# Altium schematic sheet LPDDR4.SchDoc
size A3; SheetNumber: 3; SheetTotal: 20
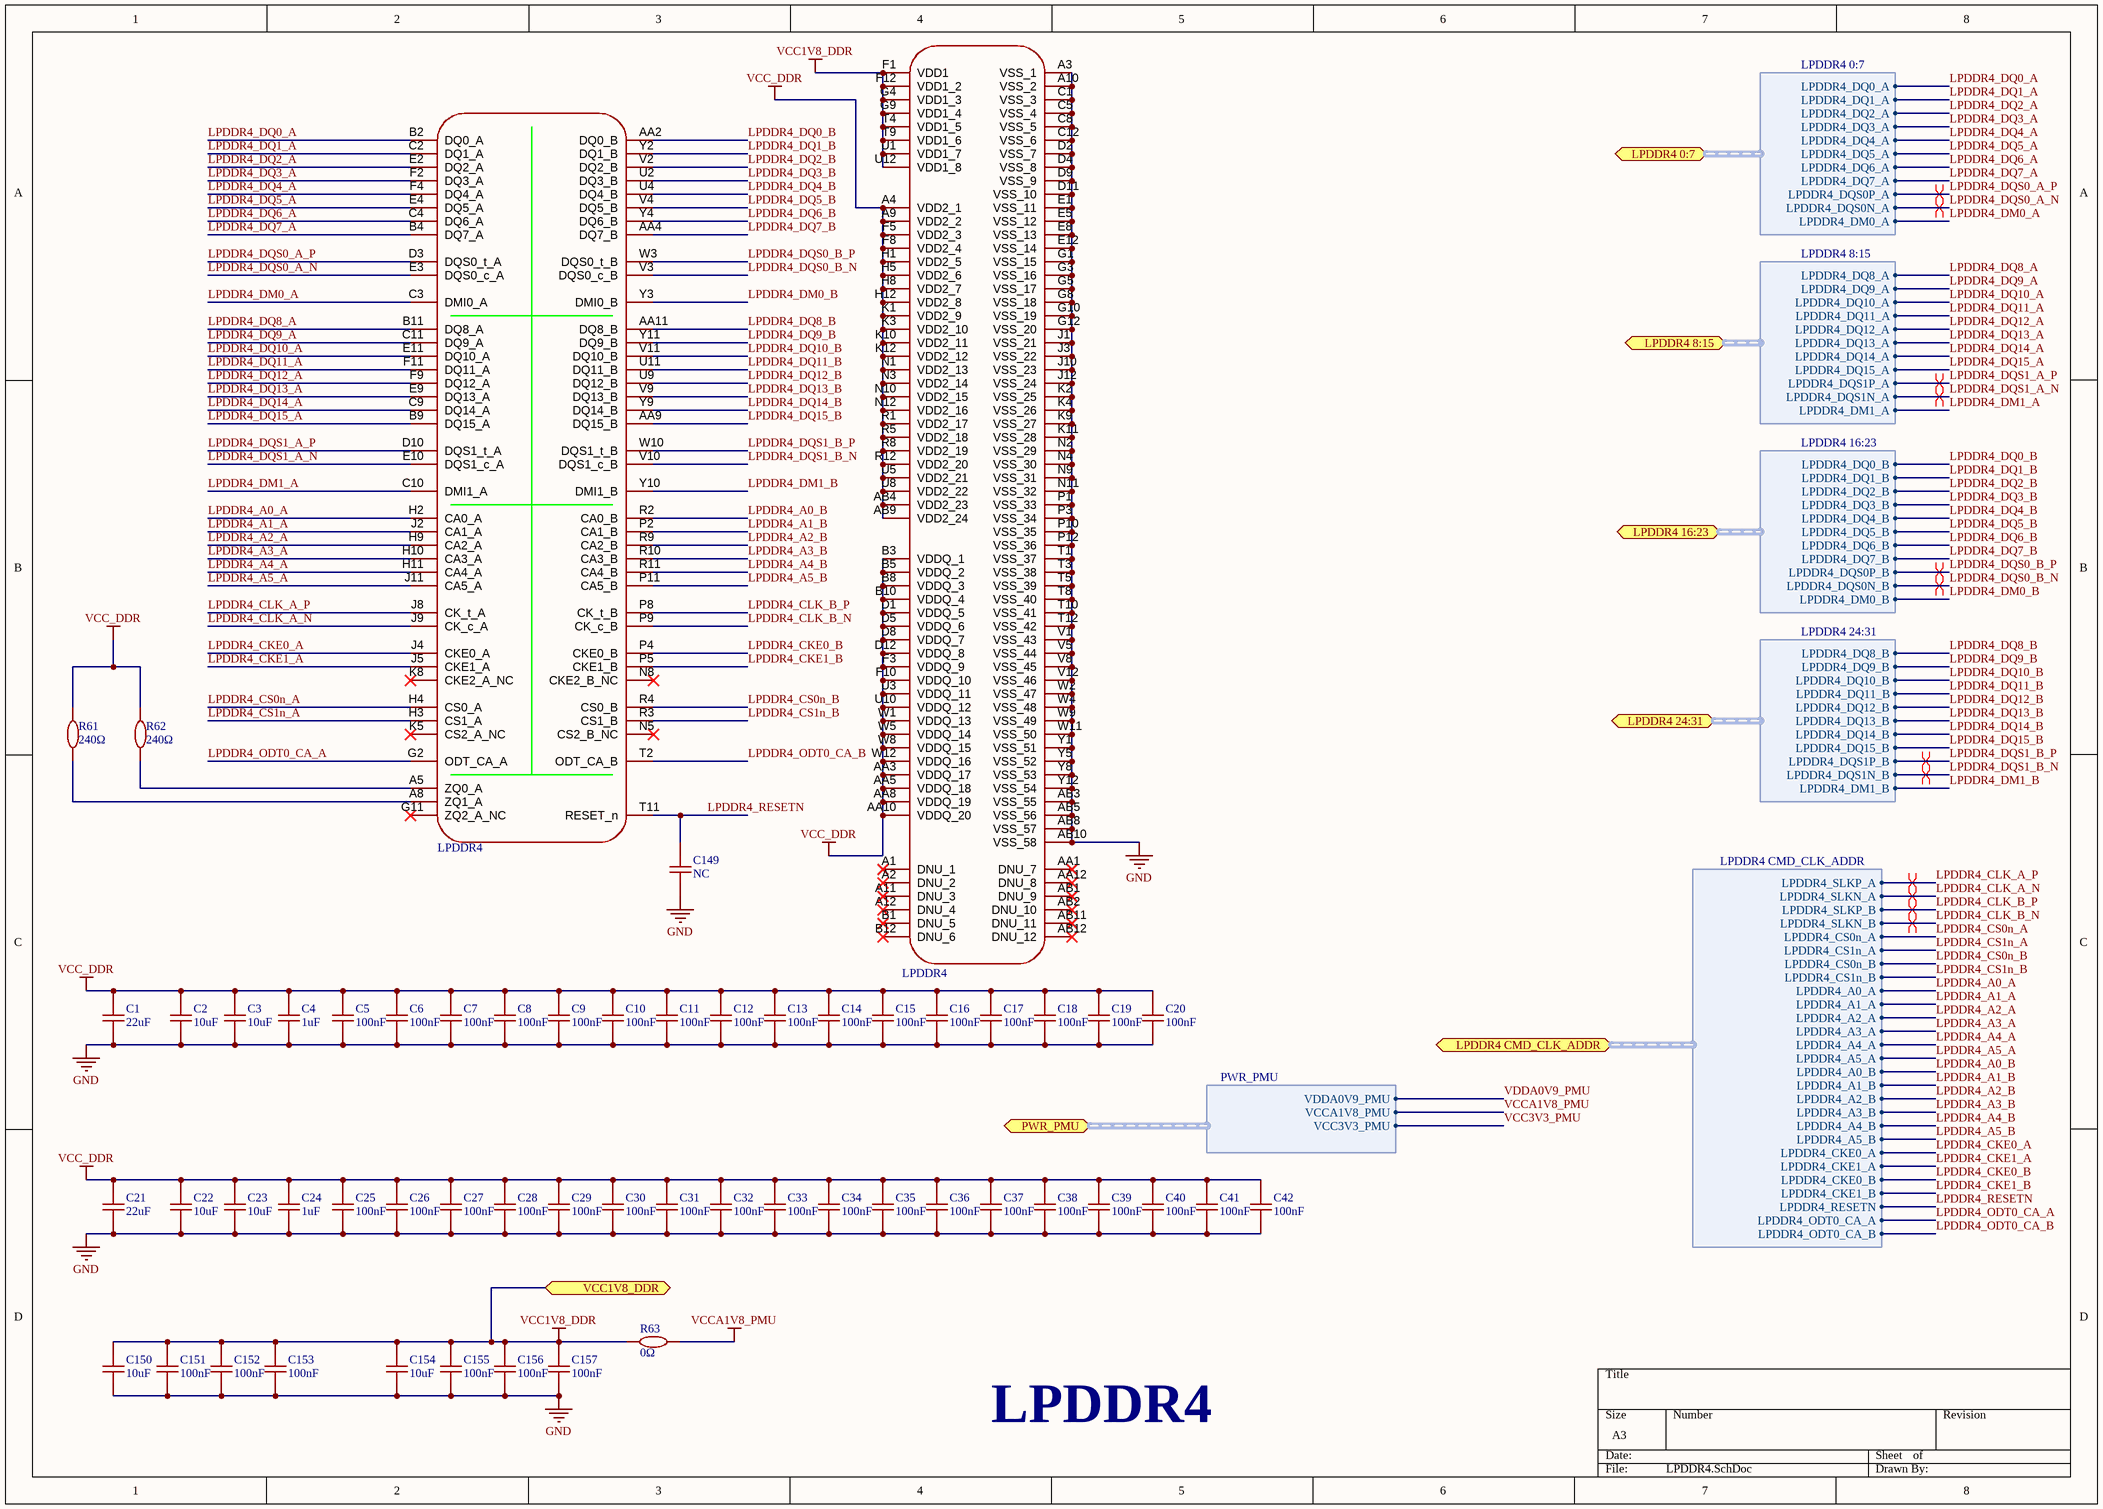
[diagram p0: LPDDR4.SchDoc]

## Parts
C1  22uF  [C0603]
C2  10uF  [C0603]
C3  10uF  [C0603]
C4  1uF  [C0402]
C5  100nF  [C0402]
C6  100nF  [C0402]
C7  100nF  [C0402]
C8  100nF  [C0402]
C9  100nF  [C0402]
C10  100nF  [C0402]
C11  100nF  [C0402]
C12  100nF  [C0402]
C13  100nF  [C0402]
C14  100nF  [C0402]
C15  100nF  [C0402]
C16  100nF  [C0402]
C17  100nF  [C0402]
C18  100nF  [C0402]
C19  100nF  [C0402]
C20  100nF  [C0402]
C21  22uF  [C0603]
C22  10uF  [C0603]
C23  10uF  [C0603]
C24  1uF  [C0402]
C25  100nF  [C0402]
C26  100nF  [C0402]
C27  100nF  [C0402]
C28  100nF  [C0402]
C29  100nF  [C0402]
C30  100nF  [C0402]
C31  100nF  [C0402]
C32  100nF  [C0402]
C33  100nF  [C0402]
C34  100nF  [C0402]
C35  100nF  [C0402]
C36  100nF  [C0402]
C37  100nF  [C0402]
C38  100nF  [C0402]
C39  100nF  [C0402]
C40  100nF  [C0402]
C41  100nF  [C0402]
C42  100nF  [C0402]
C149  NC  [C0402]
C150  10uF  [C0603]
C151  100nF  [C0402]
C152  100nF  [C0402]
C153  100nF  [C0402]
C154  10uF  [C0603]
C155  100nF  [C0402]
C156  100nF  [C0402]
C157  100nF  [C0402]
R61  240Ω  [R0402]
R62  240Ω  [R0402]
R63  0Ω  [R0402]
U1  LPDDR4  [FBGA-200_L15.0-W10.0-BL_H9HCNNNBKUMLXR]  (parts A,B of 2)

## Ports
LPDDR4 0:7 (bidir, harness LPDDR4 0:7, see Overview[6B], RK3566[2A], RK3566_DDR_PHY[3@]), LPDDR4 8:15 (bidir, harness LPDDR4 8:15, see Overview[6B], RK3566[2A], RK3566_DDR_PHY[3@]), LPDDR4 16:23 (bidir, harness LPDDR4 16:23, see Overview[6B], RK3566[2A], RK3566_DDR_PHY[3A]), LPDDR4 24:31 (bidir, harness LPDDR4 24:31, see Overview[6B], RK3566[2A], RK3566_DDR_PHY[3B]), LPDDR4 CMD_CLK_ADDR (bidir, harness LPDDR4 CMD_CLK_ADDR, see Overview[6B], RK3566[2A], RK3566_DDR_PHY[3C]), PWR_PMU (bidir, harness PWR_PMU, see Overview[7B], POWER[2D], POWER_PMIC[4D], RK3566[3C], RK3566_OSC_PLL_PMUO1_2[1A]), VCC1V8_DDR (bidir)

## Harnesses
LPDDR4 0:7: LPDDR4_DQ0_A, LPDDR4_DQ1_A, LPDDR4_DQ2_A, LPDDR4_DQ3_A, LPDDR4_DQ4_A, LPDDR4_DQ5_A, LPDDR4_DQ6_A, LPDDR4_DQ7_A, LPDDR4_DQS0P_A, LPDDR4_DQS0N_A, LPDDR4_DM0_A
LPDDR4 8:15: LPDDR4_DQ8_A, LPDDR4_DQ9_A, LPDDR4_DQ10_A, LPDDR4_DQ11_A, LPDDR4_DQ12_A, LPDDR4_DQ13_A, LPDDR4_DQ14_A, LPDDR4_DQ15_A, LPDDR4_DQS1P_A, LPDDR4_DQS1N_A, LPDDR4_DM1_A
LPDDR4 16:23: LPDDR4_DQ0_B, LPDDR4_DQ1_B, LPDDR4_DQ2_B, LPDDR4_DQ3_B, LPDDR4_DQ4_B, LPDDR4_DQ5_B, LPDDR4_DQ6_B, LPDDR4_DQ7_B, LPDDR4_DQS0P_B, LPDDR4_DQS0N_B, LPDDR4_DM0_B
LPDDR4 24:31: LPDDR4_DQ8_B, LPDDR4_DQ9_B, LPDDR4_DQ10_B, LPDDR4_DQ11_B, LPDDR4_DQ12_B, LPDDR4_DQ13_B, LPDDR4_DQ14_B, LPDDR4_DQ15_B, LPDDR4_DQS1P_B, LPDDR4_DQS1N_B, LPDDR4_DM1_B
LPDDR4 CMD_CLK_ADDR: LPDDR4_SLKP_A, LPDDR4_SLKN_A, LPDDR4_SLKP_B, LPDDR4_SLKN_B, LPDDR4_CS0n_A, LPDDR4_CS1n_A, LPDDR4_CS0n_B, LPDDR4_CS1n_B, LPDDR4_A0_A, LPDDR4_A1_A, LPDDR4_A2_A, LPDDR4_A3_A, LPDDR4_A4_A, LPDDR4_A5_A, LPDDR4_A0_B, LPDDR4_A1_B, LPDDR4_A2_B, LPDDR4_A3_B, LPDDR4_A4_B, LPDDR4_A5_B, LPDDR4_CKE0_A, LPDDR4_CKE1_A, LPDDR4_CKE0_B, LPDDR4_CKE1_B, LPDDR4_RESETN, LPDDR4_ODT0_CA_A, LPDDR4_ODT0_CA_B
PWR_PMU: VCCA1V8_PMU, VDDA0V9_PMU, VCC3V3_PMU

## Nets
GND: C1.1 C2.1 C3.1 C4.1 C5.1 C6.1 C7.1 C8.1 C9.1 C10.1 C11.1 C12.1 C13.1 C14.1 C15.1 C16.1 C17.1 C18.1 C19.1 C20.1 C21.1 C22.1 C23.1 C24.1 C25.1 C26.1 C27.1 C28.1 C29.1 C30.1 C31.1 C32.1 C33.1 C34.1 C35.1 C36.1 C37.1 C38.1 C39.1 C40.1 C41.1 C42.1 C149.1 C150.1 C151.1 C152.1 C153.1 C154.1 C155.1 C156.1 C157.1 U1.A3(VSS_1) U1.A10(VSS_2) U1.AB3(VSS_55) U1.AB5(VSS_56) U1.AB8(VSS_57) U1.AB10(VSS_58) U1.C1(VSS_3) U1.C5(VSS_4) U1.C8(VSS_5) U1.C12(VSS_6) U1.D2(VSS_7) U1.D4(VSS_8) U1.D9(VSS_9) U1.D11(VSS_10) U1.E1(VSS_11) U1.E5(VSS_12) U1.E8(VSS_13) U1.E12(VSS_14) U1.G1(VSS_15) U1.G3(VSS_16) U1.G5(VSS_17) U1.G8(VSS_18) U1.G10(VSS_19) U1.G12(VSS_20) U1.J1(VSS_21) U1.J3(VSS_22) U1.J10(VSS_23) U1.J12(VSS_24) U1.K2(VSS_25) U1.K4(VSS_26) U1.K9(VSS_27) U1.K11(VSS_28) U1.N2(VSS_29) U1.N4(VSS_30) U1.N9(VSS_31) U1.N11(VSS_32) U1.P1(VSS_33) U1.P3(VSS_34) U1.P10(VSS_35) U1.P12(VSS_36) U1.T1(VSS_37) U1.T3(VSS_38) U1.T5(VSS_39) U1.T8(VSS_40) U1.T10(VSS_41) U1.T12(VSS_42) U1.V1(VSS_43) U1.V5(VSS_44) U1.V8(VSS_45) U1.V12(VSS_46) U1.W2(VSS_47) U1.W4(VSS_48) U1.W9(VSS_49) U1.W11(VSS_50) U1.Y1(VSS_51) U1.Y5(VSS_52) U1.Y8(VSS_53) U1.Y12(VSS_54)
VCC1V8_DDR: C150.2 C151.2 C152.2 C153.2 C154.2 C155.2 C156.2 C157.2 R63.1 U1.F1(VDD1) U1.F12(VDD1_2) U1.G4(VDD1_3) U1.G9(VDD1_4) U1.T4(VDD1_5) U1.T9(VDD1_6) U1.U1(VDD1_7) U1.U12(VDD1_8) ; port VCC1V8_DDR
VCC_DDR: C1.2 C2.2 C3.2 C4.2 C5.2 C6.2 C7.2 C8.2 C9.2 C10.2 C11.2 C12.2 C13.2 C14.2 C15.2 C16.2 C17.2 C18.2 C19.2 C20.2 C21.2 C22.2 C23.2 C24.2 C25.2 C26.2 C27.2 C28.2 C29.2 C30.2 C31.2 C32.2 C33.2 C34.2 C35.2 C36.2 C37.2 C38.2 C39.2 C40.2 C41.2 C42.2 R61.2 R62.2 U1.A4(VDD2_1) U1.A9(VDD2_2) U1.AA3(VDDQ_17) U1.AA5(VDDQ_18) U1.AA8(VDDQ_19) U1.AA10(VDDQ_20) U1.AB4(VDD2_23) U1.AB9(VDD2_24) U1.B3(VDDQ_1) U1.B5(VDDQ_2) U1.B8(VDDQ_3) U1.B10(VDDQ_4) U1.D1(VDDQ_5) U1.D5(VDDQ_6) U1.D8(VDDQ_7) U1.D12(VDDQ_8) U1.F3(VDDQ_9) U1.F5(VDD2_3) U1.F8(VDD2_4) U1.F10(VDDQ_10) U1.H1(VDD2_5) U1.H5(VDD2_6) U1.H8(VDD2_7) U1.H12(VDD2_8) U1.K1(VDD2_9) U1.K3(VDD2_10) U1.K10(VDD2_11) U1.K12(VDD2_12) U1.N1(VDD2_13) U1.N3(VDD2_14) U1.N10(VDD2_15) U1.N12(VDD2_16) U1.R1(VDD2_17) U1.R5(VDD2_18) U1.R8(VDD2_19) U1.R12(VDD2_20) U1.U3(VDDQ_11) U1.U5(VDD2_21) U1.U8(VDD2_22) U1.U10(VDDQ_12) U1.W1(VDDQ_13) U1.W5(VDDQ_14) U1.W8(VDDQ_15) U1.W12(VDDQ_16)
VCCA1V8_PMU: R63.2 ; port PWR_PMU.VCCA1V8_PMU
LPDDR4_A0_A: U1.H2(CA0_A) ; port LPDDR4 CMD_CLK_ADDR.LPDDR4_A0_A
LPDDR4_A0_B: U1.R2(CA0_B) ; port LPDDR4 CMD_CLK_ADDR.LPDDR4_A0_B
LPDDR4_A1_A: U1.J2(CA1_A) ; port LPDDR4 CMD_CLK_ADDR.LPDDR4_A1_A
LPDDR4_A1_B: U1.P2(CA1_B) ; port LPDDR4 CMD_CLK_ADDR.LPDDR4_A1_B
LPDDR4_A2_A: U1.H9(CA2_A) ; port LPDDR4 CMD_CLK_ADDR.LPDDR4_A2_A
LPDDR4_A2_B: U1.R9(CA2_B) ; port LPDDR4 CMD_CLK_ADDR.LPDDR4_A2_B
LPDDR4_A3_A: U1.H10(CA3_A) ; port LPDDR4 CMD_CLK_ADDR.LPDDR4_A3_A
LPDDR4_A3_B: U1.R10(CA3_B) ; port LPDDR4 CMD_CLK_ADDR.LPDDR4_A3_B
LPDDR4_A4_A: U1.H11(CA4_A) ; port LPDDR4 CMD_CLK_ADDR.LPDDR4_A4_A
LPDDR4_A4_B: U1.R11(CA4_B) ; port LPDDR4 CMD_CLK_ADDR.LPDDR4_A4_B
LPDDR4_A5_A: U1.J11(CA5_A) ; port LPDDR4 CMD_CLK_ADDR.LPDDR4_A5_A
LPDDR4_A5_B: U1.P11(CA5_B) ; port LPDDR4 CMD_CLK_ADDR.LPDDR4_A5_B
LPDDR4_CKE0_A: U1.J4(CKE0_A) ; port LPDDR4 CMD_CLK_ADDR.LPDDR4_CKE0_A
LPDDR4_CKE0_B: U1.P4(CKE0_B) ; port LPDDR4 CMD_CLK_ADDR.LPDDR4_CKE0_B
LPDDR4_CKE1_A: U1.J5(CKE1_A) ; port LPDDR4 CMD_CLK_ADDR.LPDDR4_CKE1_A
LPDDR4_CKE1_B: U1.P5(CKE1_B) ; port LPDDR4 CMD_CLK_ADDR.LPDDR4_CKE1_B
LPDDR4_CLK_A_N: U1.J9(CK_c_A) ; port LPDDR4 CMD_CLK_ADDR.LPDDR4_SLKN_A
LPDDR4_CLK_A_P: U1.J8(CK_t_A) ; port LPDDR4 CMD_CLK_ADDR.LPDDR4_SLKP_A
LPDDR4_CLK_B_N: U1.P9(CK_c_B) ; port LPDDR4 CMD_CLK_ADDR.LPDDR4_SLKN_B
LPDDR4_CLK_B_P: U1.P8(CK_t_B) ; port LPDDR4 CMD_CLK_ADDR.LPDDR4_SLKP_B
LPDDR4_CS0n_A: U1.H4(CS0_A) ; port LPDDR4 CMD_CLK_ADDR.LPDDR4_CS0n_A
LPDDR4_CS0n_B: U1.R4(CS0_B) ; port LPDDR4 CMD_CLK_ADDR.LPDDR4_CS0n_B
LPDDR4_CS1n_A: U1.H3(CS1_A) ; port LPDDR4 CMD_CLK_ADDR.LPDDR4_CS1n_A
LPDDR4_CS1n_B: U1.R3(CS1_B) ; port LPDDR4 CMD_CLK_ADDR.LPDDR4_CS1n_B
LPDDR4_DM0_A: U1.C3(DMI0_A) ; port LPDDR4 0:7.LPDDR4_DM0_A
LPDDR4_DM0_B: U1.Y3(DMI0_B) ; port LPDDR4 16:23.LPDDR4_DM0_B
LPDDR4_DM1_A: U1.C10(DMI1_A) ; port LPDDR4 8:15.LPDDR4_DM1_A
LPDDR4_DM1_B: U1.Y10(DMI1_B) ; port LPDDR4 24:31.LPDDR4_DM1_B
LPDDR4_DQ0_A: U1.B2(DQ0_A) ; port LPDDR4 0:7.LPDDR4_DQ0_A
LPDDR4_DQ0_B: U1.AA2(DQ0_B) ; port LPDDR4 16:23.LPDDR4_DQ0_B
LPDDR4_DQ1_A: U1.C2(DQ1_A) ; port LPDDR4 0:7.LPDDR4_DQ1_A
LPDDR4_DQ1_B: U1.Y2(DQ1_B) ; port LPDDR4 16:23.LPDDR4_DQ1_B
LPDDR4_DQ2_A: U1.E2(DQ2_A) ; port LPDDR4 0:7.LPDDR4_DQ2_A
LPDDR4_DQ2_B: U1.V2(DQ2_B) ; port LPDDR4 16:23.LPDDR4_DQ2_B
LPDDR4_DQ3_A: U1.F2(DQ3_A) ; port LPDDR4 0:7.LPDDR4_DQ3_A
LPDDR4_DQ3_B: U1.U2(DQ3_B) ; port LPDDR4 16:23.LPDDR4_DQ3_B
LPDDR4_DQ4_A: U1.F4(DQ4_A) ; port LPDDR4 0:7.LPDDR4_DQ4_A
LPDDR4_DQ4_B: U1.U4(DQ4_B) ; port LPDDR4 16:23.LPDDR4_DQ4_B
LPDDR4_DQ5_A: U1.E4(DQ5_A) ; port LPDDR4 0:7.LPDDR4_DQ5_A
LPDDR4_DQ5_B: U1.V4(DQ5_B) ; port LPDDR4 16:23.LPDDR4_DQ5_B
LPDDR4_DQ6_A: U1.C4(DQ6_A) ; port LPDDR4 0:7.LPDDR4_DQ6_A
LPDDR4_DQ6_B: U1.Y4(DQ6_B) ; port LPDDR4 16:23.LPDDR4_DQ6_B
LPDDR4_DQ7_A: U1.B4(DQ7_A) ; port LPDDR4 0:7.LPDDR4_DQ7_A
LPDDR4_DQ7_B: U1.AA4(DQ7_B) ; port LPDDR4 16:23.LPDDR4_DQ7_B
LPDDR4_DQ8_A: U1.B11(DQ8_A) ; port LPDDR4 8:15.LPDDR4_DQ8_A
LPDDR4_DQ8_B: U1.AA11(DQ8_B) ; port LPDDR4 24:31.LPDDR4_DQ8_B
LPDDR4_DQ9_A: U1.C11(DQ9_A) ; port LPDDR4 8:15.LPDDR4_DQ9_A
LPDDR4_DQ9_B: U1.Y11(DQ9_B) ; port LPDDR4 24:31.LPDDR4_DQ9_B
LPDDR4_DQ10_A: U1.E11(DQ10_A) ; port LPDDR4 8:15.LPDDR4_DQ10_A
LPDDR4_DQ10_B: U1.V11(DQ10_B) ; port LPDDR4 24:31.LPDDR4_DQ10_B
LPDDR4_DQ11_A: U1.F11(DQ11_A) ; port LPDDR4 8:15.LPDDR4_DQ11_A
LPDDR4_DQ11_B: U1.U11(DQ11_B) ; port LPDDR4 24:31.LPDDR4_DQ11_B
LPDDR4_DQ12_A: U1.F9(DQ12_A) ; port LPDDR4 8:15.LPDDR4_DQ12_A
LPDDR4_DQ12_B: U1.U9(DQ12_B) ; port LPDDR4 24:31.LPDDR4_DQ12_B
LPDDR4_DQ13_A: U1.E9(DQ13_A) ; port LPDDR4 8:15.LPDDR4_DQ13_A
LPDDR4_DQ13_B: U1.V9(DQ13_B) ; port LPDDR4 24:31.LPDDR4_DQ13_B
LPDDR4_DQ14_A: U1.C9(DQ14_A) ; port LPDDR4 8:15.LPDDR4_DQ14_A
LPDDR4_DQ14_B: U1.Y9(DQ14_B) ; port LPDDR4 24:31.LPDDR4_DQ14_B
LPDDR4_DQ15_A: U1.B9(DQ15_A) ; port LPDDR4 8:15.LPDDR4_DQ15_A
LPDDR4_DQ15_B: U1.AA9(DQ15_B) ; port LPDDR4 24:31.LPDDR4_DQ15_B
LPDDR4_DQS0_A_N: U1.E3(DQS0_c_A) ; port LPDDR4 0:7.LPDDR4_DQS0N_A
LPDDR4_DQS0_A_P: U1.D3(DQS0_t_A) ; port LPDDR4 0:7.LPDDR4_DQS0P_A
LPDDR4_DQS0_B_N: U1.V3(DQS0_c_B) ; port LPDDR4 16:23.LPDDR4_DQS0N_B
LPDDR4_DQS0_B_P: U1.W3(DQS0_t_B) ; port LPDDR4 16:23.LPDDR4_DQS0P_B
LPDDR4_DQS1_A_N: U1.E10(DQS1_c_A) ; port LPDDR4 8:15.LPDDR4_DQS1N_A
LPDDR4_DQS1_A_P: U1.D10(DQS1_t_A) ; port LPDDR4 8:15.LPDDR4_DQS1P_A
LPDDR4_DQS1_B_N: U1.V10(DQS1_c_B) ; port LPDDR4 24:31.LPDDR4_DQS1N_B
LPDDR4_DQS1_B_P: U1.W10(DQS1_t_B) ; port LPDDR4 24:31.LPDDR4_DQS1P_B
LPDDR4_ODT0_CA_A: U1.G2(ODT_CA_A) ; port LPDDR4 CMD_CLK_ADDR.LPDDR4_ODT0_CA_A
LPDDR4_ODT0_CA_B: U1.T2(ODT_CA_B) ; port LPDDR4 CMD_CLK_ADDR.LPDDR4_ODT0_CA_B
LPDDR4_RESETN: C149.2 U1.T11(RESET_n) ; port LPDDR4 CMD_CLK_ADDR.LPDDR4_RESETN
VCC3V3_PMU: port PWR_PMU.VCC3V3_PMU
VDDA0V9_PMU: port PWR_PMU.VDDA0V9_PMU
NetR61_1: R61.1 U1.A8(ZQ1_A)
NetR62_1: R62.1 U1.A5(ZQ0_A)

Not connected (* = marked no-connect by the designer): U1 A1(DNU_1)* A2(DNU_2)* A11(DNU_3)* A12(DNU_4)* AA1(DNU_7)* AA12(DNU_8)* AB1(DNU_9)* AB2(DNU_10)* AB11(DNU_11)* AB12(DNU_12)* B1(DNU_5)* B12(DNU_6)* G11(ZQ2_A_NC)* K5(CS2_A_NC)* K8(CKE2_A_NC)* N5(CS2_B_NC)* N8(CKE2_B_NC)*

## Layout directives
differential pair: LPDDR4_CLK_A_N, LPDDR4_CLK_A_P, LPDDR4_CLK_B_N, LPDDR4_CLK_B_P, LPDDR4_DQS0_A_N, LPDDR4_DQS0_A_P, LPDDR4_DQS0_B_N, LPDDR4_DQS0_B_P, LPDDR4_DQS1_A_N, LPDDR4_DQS1_A_P, LPDDR4_DQS1_B_N, LPDDR4_DQS1_B_P

## Notes on the sheet
- LPDDR4

## Library data of the parts
C1 C21 = 22uF: 16V 22uF X5R ±20% 0603 Ceramic Capacitors ROHS
C2 C3 C22 C23 C150 C154 = 10uF: 10V 10uF X5R ±10% 0603 Ceramic Capacitors ROHS
C4 C24 = 1uF: 50V 1uF X5R ±10% 0402 Ceramic Capacitors ROHS
C5-C20 C25-C42 C151-C153 C155-C157 = 100nF: 50V 100nF X7R ±10% 0402 Ceramic Capacitors ROHS
C149 = 10nF: 50V 10nF X7R ±10% 0402 Ceramic Capacitors ROHS
R61 R62 = 240Ω: 240Ω 62.5mW 50V ±100ppm/℃ Thick Film Resistor ±1% 0402 Chip Resistor - Surface Mount ROHS
R63 = 0Ω: 0Ω 62.5mW 50V Thick Film Resistor ±1% 0402 Chip Resistor - Surface Mount ROHS
U1 = LPDDR4: LPDDR4 - SDRAM是一种高速同步DRAM器件，内部配置有1个或2个通道。单通道由8个存储体组成，每通道密度为1 Gb至16 Gb。双通道由8个存储体组成，每通道密度为2 Gb至32 Gb; Symbol: H9HCNNNBKUMLXR-NEE